# Altium schematic sheet Sync Transformer.SchDoc
size A
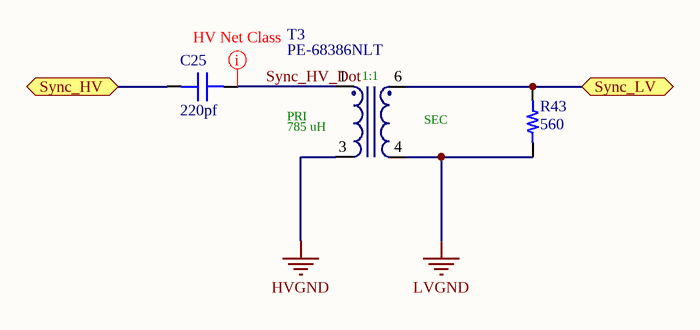
[diagram p0: Sync Transformer.SchDoc]

## Parts
C25  value 220pf  [CAP 0603/1608]  (hidden comment: Capacitor MLCC 220pf 25V CAP 0603/1608)
R43  value 560  [RES 0603/1608]  (hidden comment: Resistor 560 0603 1/10W 1%)
T3  Sync Transformer  [PE-68386NLT]  (value not drawn)

## Ports
Sync_HV (bidir), Sync_LV (bidir)

## Nets
HVGND: T3.3
LVGND: R43.1 T3.4
Sync_HV: C25.1 ; port Sync_HV
Sync_HV_Dot: C25.2 T3.1
Sync_LV: R43.2 T3.6 ; port Sync_LV

## Layout directives
net class HV: Sync_HV_Dot

## Notes on the sheet
- (in symbol 2) 1:1; PRI; SEC; 785 uH

## Library data of the parts
C25 = 537: Manufacturer_id: 1; idCapacitor: 537; Name: Cap_220pf_25V_CAP 0603/1608; Dielectric: Ceramic; Created_By: Nick Mah; Drawer_id: 1; Voltage_Rating: 25V; Package: CAP 0603/1608; Created_Date: 10/20/2018
R43 = 283: Manufacturer_id: 1; idResistor: 283; Name: Res_560_0603_1/10W_1%; Created_By: Nick Mah; Supplier 1: Digi-Key; Drawer_id: 1; Tolerance: 1%; Power: 1/10W; Package: 0603; ComponentLink1Description: Datasheet; Created_Date: 2018-10-20
T3 = 2: PULSE XFMR 1:1 785UH; Manufacturer_id: 1; idTransformer: 2; Name: 500W DC-DC Sync Trfrmr; Value: 785uH - 1:1; Voltage_Primary: 380Vrms; Created_By: Nick Mah; Drawer_id: 1; Package: SMD; MfrPartNo: PE-68386NLT; Link: https://www.digikey.com/product-detail/en/pulse-electronics-power/PE-68386NLT/553-1776-1-ND/4494729; ComponentLink1Description: Datasheet; ComponentLink1URL: file:///C:/Users/Nick%20Mah/Downloads/SPM2007_61.pdf; Supplier1: Digi-Key; Supplier1PartNo: 553-1776-1-ND